# Altium schematic sheet 松菸_幻影光靈_屍禁_4順序按鈕.SchDoc
size A4
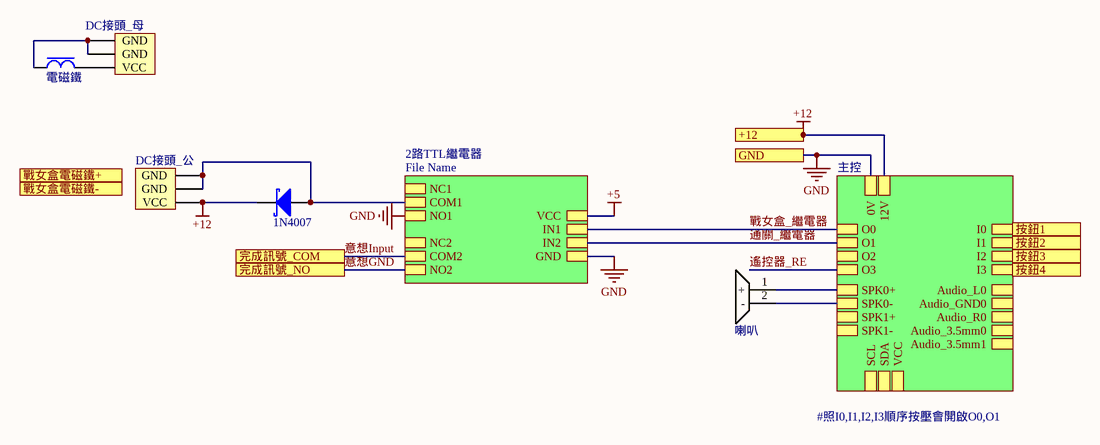
[diagram p0: 松菸_幻影光靈_屍禁_4順序按鈕.SchDoc]

## Parts
B38  喇叭  [Buzzer_12085]
Cn94  DC接頭_母  [Connector_DC-005]
Cn95  DC接頭_公  [Connector_DC-005]
I10  電磁鐵  [Inductor-0420]
SD1  1N4007  [Diode_SMA]

## Sub-sheets
2路TTL繼電器 = File Name: NC2, NC1, COM2, COM1, NO2, NO1, VCC, IN1, IN2, GND
主控 = ESP32主控_20240812.SchDoc: 12V, SDA, VCC, 0V, SCL, O3, O2, O1, O0, I3, I2, I1, I0, SPK0+, Audio_3.5mm1, Audio_L0, SPK0-, Audio_R0, SPK1+, SPK1-, Audio_3.5mm0, Audio_GND0

## Ports
+12, GND, 完成訊號_COM, 完成訊號_NO, 戰女盒電磁鐵+, 戰女盒電磁鐵-, 按鈕1, 按鈕2, 按鈕3, 按鈕4

## Nets
+5: sheet 2路TTL繼電器/VCC
+12: Cn95.1(VCC) SD1.1(K) ; port +12, sheet 主控/12V
GND: port GND, sheet 主控/0V, sheet 2路TTL繼電器/NO1, sheet 2路TTL繼電器/GND
意想GND: port 完成訊號_NO, sheet 2路TTL繼電器/NO2
意想Input: port 完成訊號_COM, sheet 2路TTL繼電器/COM2
戰女盒_繼電器: sheet 主控/O0, sheet 2路TTL繼電器/IN1
按鈕1: port 按鈕1, sheet 主控/I0
按鈕2: port 按鈕2, sheet 主控/I1
按鈕3: port 按鈕3, sheet 主控/I2
按鈕4: port 按鈕4, sheet 主控/I3
通關_繼電器: sheet 主控/O1, sheet 2路TTL繼電器/IN2
遙控器_RE: sheet 主控/O3
NetB38_1: B38.1(+) ; sheet 主控/SPK0+
NetB38_2: B38.2(-) ; sheet 主控/SPK0-
NetCn94_1: Cn94.1(VCC) I10.1
NetCn94_2: Cn94.2(GND) Cn94.3(GND) I10.2
NetCn95_2: Cn95.2(GND) Cn95.3(GND) SD1.2(A) ; sheet 2路TTL繼電器/COM1

## Notes on the sheet
- #照I0,I1,I2,I3順序按壓會開啟O0,O1

## Library data of the parts
B38 = Buzzer: 無源蜂鳴器
Cn94 Cn95 = Contact_DC: 連接器,DC直流接頭
I10 = Inductor: 一體成型電感
SD1 = Diode_Schottky: 二極體_蕭特基